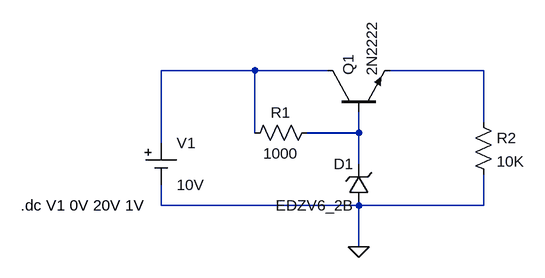
[diagram p0: schematic Series Voltage Regulator 1.asc]
Series Voltage Regulator 1.asc, the LTspice schematic file:
Version 4
SHEET 1 880 680
WIRE -32 32 -176 32
WIRE 80 32 -32 32
WIRE 320 32 176 32
WIRE 320 112 320 32
WIRE -32 128 -32 32
WIRE 128 128 128 96
WIRE 128 128 48 128
WIRE -176 144 -176 32
WIRE 128 176 128 128
WIRE -176 240 -176 208
WIRE 128 240 -176 240
WIRE 320 240 320 192
WIRE 320 240 128 240
WIRE 128 304 128 240
FLAG 128 304 0
SYMBOL npn 80 96 R270
SYMATTR InstName Q1
SYMATTR Value 2N2222
SYMBOL zener 144 240 R180
WINDOW 0 24 64 Left 2
WINDOW 3 24 0 Left 2
SYMATTR InstName D1
SYMATTR Value EDZV6_2B
SYMBOL Misc\\cell -176 144 R0
WINDOW 123 0 0 Left 0
WINDOW 39 0 0 Left 0
SYMATTR InstName V1
SYMATTR Value 10V
SYMBOL res 304 96 R0
SYMATTR InstName R2
SYMATTR Value 10K
SYMBOL res 64 112 R90
WINDOW 0 0 56 VBottom 2
WINDOW 3 32 56 VTop 2
SYMATTR InstName R1
SYMATTR Value 1000
TEXT -392 240 Left 2 !.dc V1 0V 20V 1V

The netlist it stands for:
* Series Voltage Regulator 1.asc
Q1 N001 N003 N002 0 2N2222
D1 0 N003 EDZV6_2B
V1 N001 0 10V
R2 N002 0 10K
R1 N003 N001 1000
.model D D
.lib standard.dio
.model NPN NPN
.model PNP PNP
.lib standard.bjt
.dc V1 0V 20V 1V
.backanno
.end